# EAGLE design Caff_v3 (EAGLE 9.6.2)
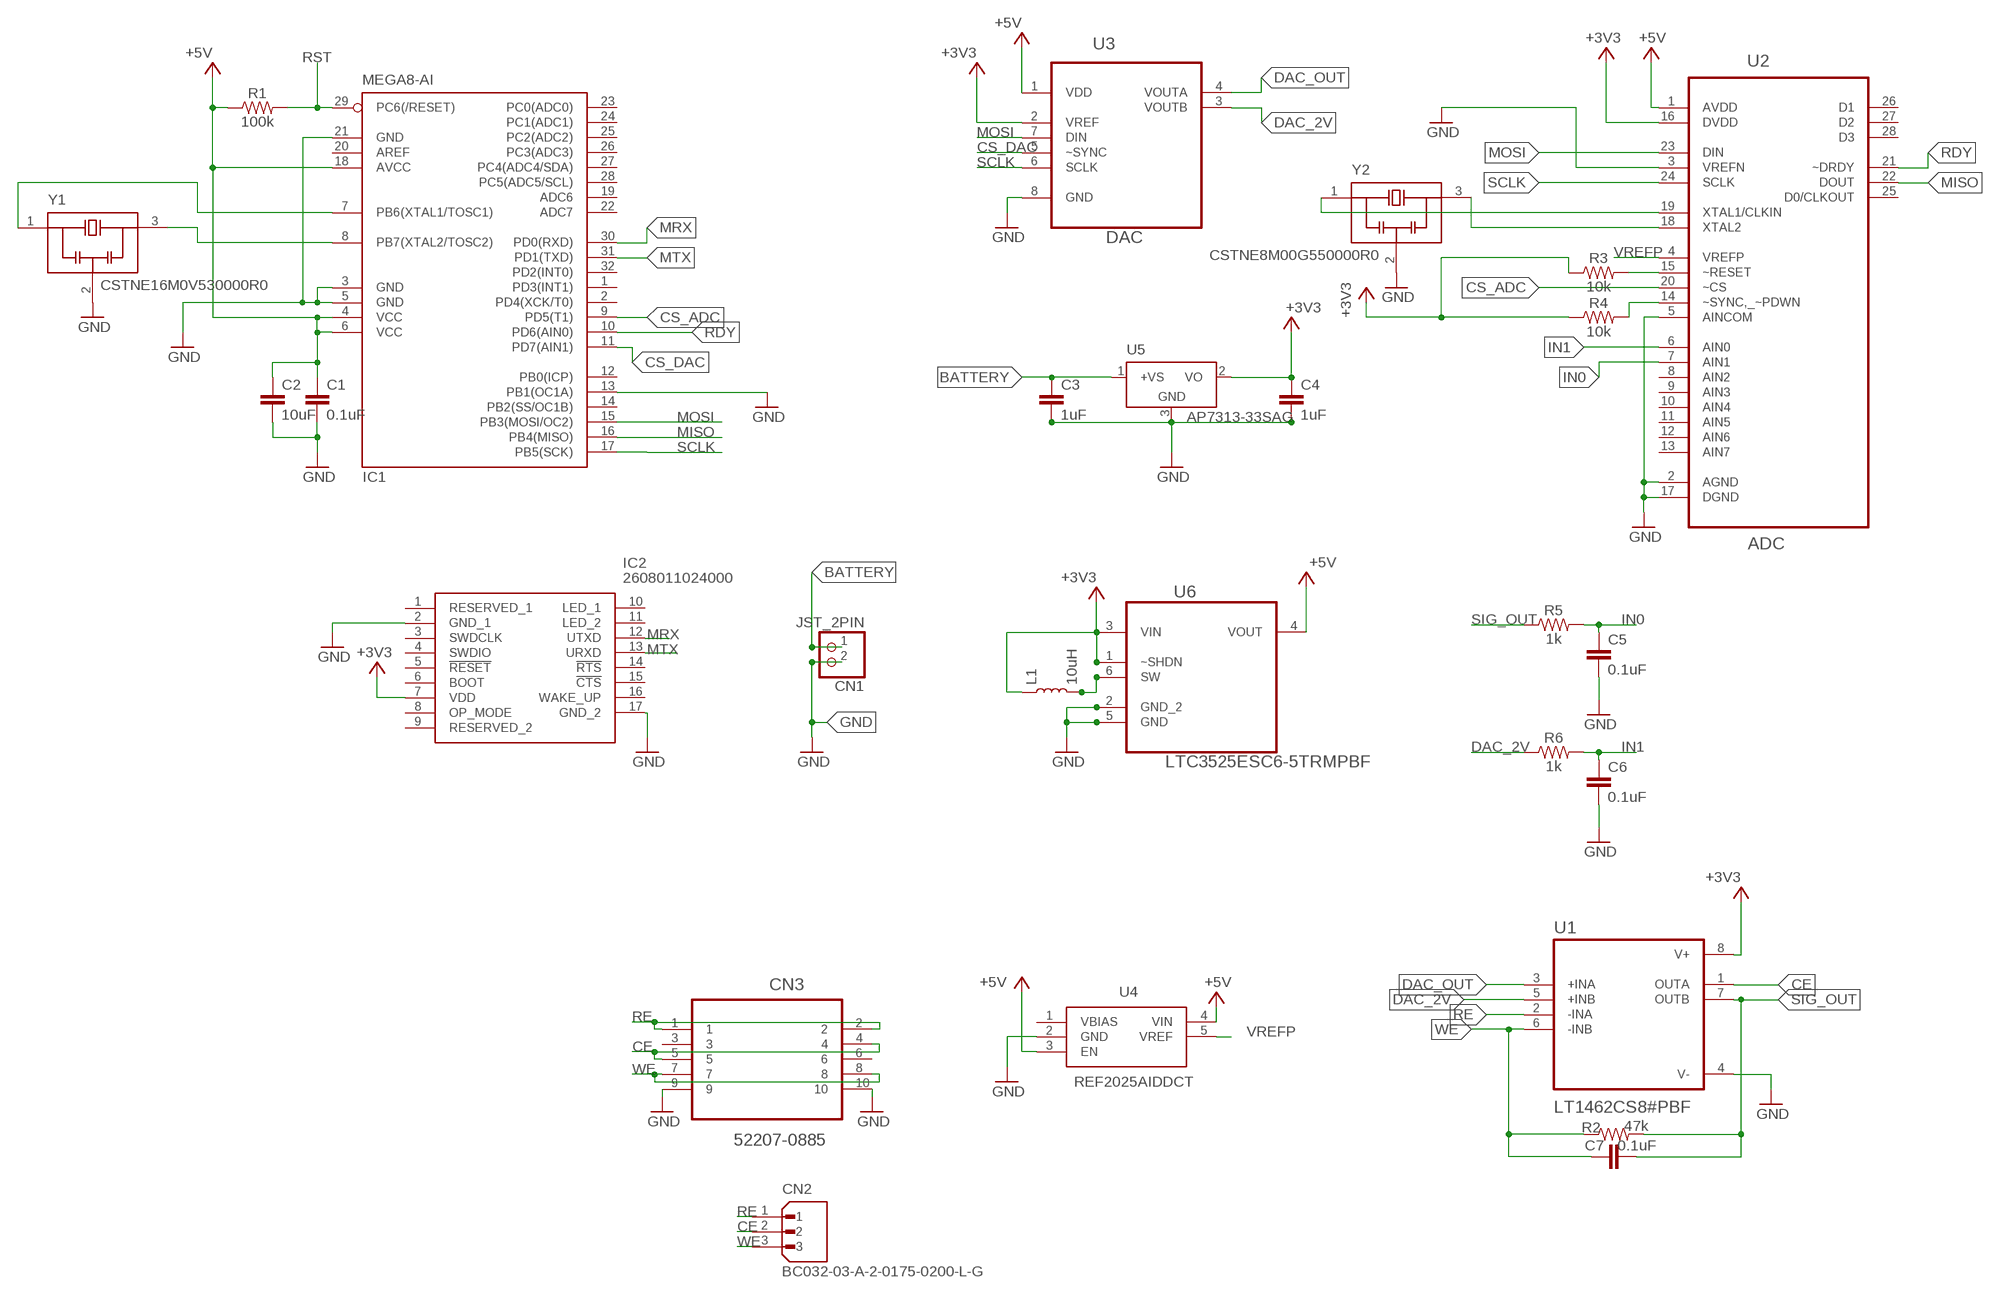
[diagram p0: schematic, sheet 1]

## Parts
C1  0.1uF  0.1UF-0603-25V-5%  [0603]
C2  10uF  10UF-0603-6.3V-20%  [0603]
C3  1uF  0.1UF-0603-25V-(+80/-20%)  [0603]
C4  1uF  0.1UF-0603-25V-(+80/-20%)  [0603]
C5  0.1uF  0.1UF-0603-25V-(+80/-20%)  [0603]
C6  0.1uF  0.1UF-0603-25V-(+80/-20%)  [0603]
C7  0.1uF  0.1UF-0603-25V-5%  [0603]
CN1  JST_2PIN  JST_2PIN-SMT-RA  [JST-PH-2-SMT-RA]
CN2  BC032-03-A-2-0175-0200-L-G  [GCT_BC032-03-A-2-0175-0200-L-G]
CN3  52207-0885  [MOLEX_52207-0885]
IC1  MEGA8-AI  [TQFP32-08]
IC2  2608011024000  [2608011024000]
L1  10uH  INDUCTOR-0603-33NH  [0603]
R1  100k  100KOHM-0603-1/10W-1%  [0603]
R2  47k  47KOHM-0603-1/10W-1%  [0603]
R3  10k  10KOHM-0603-1/10W-1%  [0603]
R4  10k  10KOHM-0603-1/10W-1%  [0603]
R5  1k  10KOHM-0603-1/10W-1%  [0603]
R6  1k  10KOHM-0603-1/10W-1%  [0603]
U1  LT1462CS8#PBF  [SOIC127P600X175-8N]
U2  ADC  ADS1256IDBR  [SOP65P780X200-28N]
U3  DAC  DAC8552IDGKT  [SOP65P490X110-8N]
U4  REF2025AIDDCT  [SOT95P280X110-5N]
U5  AP7313-33SAG  LM50  [SOT23]
U6  LTC3525ESC6-5TRMPBF  [SOT65P210X100-6N]
Y1  CSTNE16M0V530000R0  [OSC_CSTNE16M0V530000R0]
Y2  CSTNE8M00G550000R0  CSTNE16M0V530000R0  [OSC_CSTNE16M0V530000R0]

## Nets
+3V3: C4.1 IC2.7(VDD) L1.1 R3.1 R4.1 U1.8(V+) U2.16(DVDD) U3.2(VREF) U5.2(VO) U6.1(~SHDN) U6.3(VIN)
+5V: C1.1 C2.1 IC1.4(VCC) IC1.6(VCC) IC1.18(AVCC) R1.1 U2.1(AVDD) U3.1(VDD) U4.3(EN) U4.4(VIN) U6.4(VOUT)
BATTERY: C3.1 CN1.1 U5.1(+VS)
CE: CN2.2 CN3.4 CN3.5 U1.1(OUTA)
CS_ADC: IC1.9(PD5(T1)) U2.20(~CS)
CS_DAC: IC1.11(PD7(AIN1)) U3.5(~SYNC)
DAC_2V: R6.1 U1.5(+INB) U3.3(VOUTB)
DAC_OUT: U1.3(+INA) U3.4(VOUTA)
GND: C1.2 C2.2 C3.2 C4.2 C5.2 C6.2 CN1.2 CN3.9 CN3.10 IC1.3(GND) IC1.5(GND) IC1.13(PB1(OC1A)) IC1.21(GND) IC2.2(GND_1) IC2.17(GND_2) U1.4(V-) U2.2(AGND) U2.3(VREFN) U2.5(AINCOM) U2.17(DGND) U3.8(GND) U4.2(GND) U5.3(GND) U6.2(GND_2) U6.5(GND) Y1.2(GND) Y2.2(GND)
IN0: C5.1 R5.2 U2.7(AIN1)
IN1: C6.1 R6.2 U2.6(AIN0)
MISO: IC1.16(PB4(MISO)) U2.22(DOUT)
MOSI: IC1.15(PB3(MOSI/OC2)) U2.23(DIN) U3.7(DIN)
MRX: IC1.30(PD0(RXD)) IC2.12(UTXD)
MTX: IC1.31(PD1(TXD)) IC2.13(URXD)
N$1: IC1.7(PB6(XTAL1/TOSC1)) Y1.1(IN)
N$2: IC1.8(PB7(XTAL2/TOSC2)) Y1.3(OUT)
N$3: U2.19(XTAL1/CLKIN) Y2.1(IN)
N$4: U2.18(XTAL2) Y2.3(OUT)
N$15: R3.2 U2.15(~RESET)
N$17: L1.2 U6.6(SW)
N$18: R4.2 U2.14(~SYNC,_~PDWN)
RDY: IC1.10(PD6(AIN0)) U2.21(~DRDY)
RE: CN2.1 CN3.1 CN3.2 U1.2(-INA)
RST: IC1.29(PC6(/RESET)) R1.2
SCLK: IC1.17(PB5(SCK)) U2.24(SCLK) U3.6(SCLK)
SIG_OUT: C7.2 R2.2 R5.1 U1.7(OUTB)
VREFP: U2.4(VREFP) U4.5(VREF)
WE: C7.1 CN2.3 CN3.7 CN3.8 R2.1 U1.6(-INB)
Unconnected: CN3.3 CN3.6 IC1.1(PD3(INT1)) IC1.2(PD4(XCK/T0)) IC1.12(PB0(ICP)) IC1.14(PB2(SS/OC1B)) IC1.19(ADC6) IC1.20(AREF) IC1.22(ADC7) IC1.23(PC0(ADC0)) IC1.24(PC1(ADC1)) IC1.25(PC2(ADC2)) IC1.26(PC3(ADC3)) IC1.27(PC4(ADC4/SDA)) IC1.28(PC5(ADC5/SCL)) IC1.32(PD2(INT0)) IC2.1(RESERVED_1) IC2.3(SWDCLK) IC2.4(SWDIO) IC2.5(!RESET) IC2.6(BOOT) IC2.8(OP_MODE) IC2.9(RESERVED_2) IC2.10(LED_1) IC2.11(LED_2) IC2.14(!RTS) IC2.15(!CTS) IC2.16(WAKE_UP) U2.8(AIN2) U2.9(AIN3) U2.10(AIN4) U2.11(AIN5) U2.12(AIN6) U2.13(AIN7) U2.25(D0/CLKOUT) U2.26(D1) U2.27(D2) U2.28(D3) U4.1(VBIAS)

## Library data of the parts
C1 C7 = SparkFun-Capacitors:0.1UF: 0.1µF ceramic capacitors A capacitor is a passive two-terminal electrical component used to store electrical energy temporarily in an electric field.; PROD_ID: CAP-08604
C2 = SparkFun-Capacitors:10UF: 10.0µF ceramic capacitors A capacitor is a passive two-terminal electrical component used to store electrical energy temporarily in an electric field.; PROD_ID: CAP-11015
C3 C4 = SparkFun-Capacitors:0.1UF: 0.1µF ceramic capacitors A capacitor is a passive two-terminal electrical component used to store electrical energy temporarily in an electric field.; PROD_ID: CAP-00810; VALUE: 0.1uF
C5 C6 = SparkFun-Capacitors:0.1UF: 0.1µF ceramic capacitors A capacitor is a passive two-terminal electrical component used to store electrical energy temporarily in an electric field.; PROD_ID: CAP-00810
CN1 = adafruit:JST_2PIN: JST 2-Pin Connectors of various flavors SMT-RA (S2B-PH-SM4) 4UConnector #17311 SMT (B2B-PH-SM4) THM-RA (S2B-PH) THM (B2B-PH)
CN2 = BC032-03-A-2-0175-0200-L-G:BC032-03-A-2-0175-0200-L-G: Check availability <https://pricing.snapeda.com/parts/BC032-03-A-2-0175-0200-L-G/Global%20Connector%20Technology/view-part?ref=eda>; AVAILABILITY: Not in stock; DESCRIPTION: 1.00mm pitch Header Board to Board Connector; MF: Global Connector Technology; MP: BC032-03-A-2-0175-0200-L-G; PACKAGE: Package; PRICE: None
CN3 = 52207-0885:52207-0885: SOCKET FPC, SMT, 1MM, 8 WAY; AVAILABILITY: Unavailable; DESCRIPTION: Pin and Socket Header PCB - Right-Angle 8P; MF: Molex; MP: 52207-0885; PACKAGE: None; PRICE: None
IC1 = atmel:MEGA8: MICROCONTROLLER 8 Kbytes FLASH, 1 kbytes SRAM, 512 bytes EEPROM, USART, 6-channel 10 bit ADC, 2-channel 8 bit ADC Pin compatible with Atmega48, ATMega88, ATMega168 Source: avr.lbr; MPN: ATMEGA8-16AU; OC_FARNELL: 9171371; OC_NEWARK: 73M8863
IC2 = SamacSys_Parts:2608011024000: Bluetooth Modules (802.15.1) WIRL-BTLE Proteus-I BLE4.2 Source: Datasheet <https://componentsearchengine.com/Datasheets/1/2608011024000.pdf>; DESCRIPTION: Bluetooth Modules (802.15.1) WIRL-BTLE Proteus-I BLE4.2; HEIGHT: 2.2mm; MANUFACTURER_NAME: Wurth Elektronik; MANUFACTURER_PART_NUMBER: 2608011024000; MOUSER_PART_NUMBER: 710-2608011024000; MOUSER_PRICE-STOCK: https://www.mouser.com/Search/Refine.aspx?Keyword=710-2608011024000
L1 = SparkFun-Coils:INDUCTOR: Inductors Resist changes in electrical current. Basically a coil of wire. SparkFun Products: SparkFun Load Cell Amplifier - HX711 <https://www.sparkfun.com/products/13879> IOIO-OTG - V2.2 <https://www.sparkfun.com/products/13613>; PROD_ID: NDUC-07874; VALUE: 33nH/±5%/500mA
R1 = SparkFun-Resistors:100KOHM: 100kΩ resistor A resistor is a passive two-terminal electrical component that implements electrical resistance as a circuit element. Resistors act to reduce current flow, and, at the same time, act to lower voltage levels within circuits. - Wikipedia; PROD_ID: RES-07828
R2 = SparkFun-Resistors:47KOHM: 47kΩ resistor A resistor is a passive two-terminal electrical component that implements electrical resistance as a circuit element. Resistors act to reduce current flow, and, at the same time, act to lower voltage levels within circuits. - Wikipedia; PROD_ID: RES-07871
R3 R4 = SparkFun-Resistors:10KOHM: 10kΩ resistor A resistor is a passive two-terminal electrical component that implements electrical resistance as a circuit element. Resistors act to reduce current flow, and, at the same time, act to lower voltage levels within circuits. - Wikipedia; PROD_ID: RES-00824
R5 R6 = SparkFun-Resistors:10KOHM: 10kΩ resistor A resistor is a passive two-terminal electrical component that implements electrical resistance as a circuit element. Resistors act to reduce current flow, and, at the same time, act to lower voltage levels within circuits. - Wikipedia; PROD_ID: RES-00824; VALUE: 10k
U1 = LT1462CS8_PBF:LT1462CS8#PBF: None; AVAILABILITY: Unavailable; DESCRIPTION: General Purpose Amplifier 2 Circuit 8-SO; MF: Linear Technology; MP: LT1462CS8#PBF; PACKAGE: SO-8 Linear Technology; PRICE: None
U2 = ADS1256IDBR:ADS1256IDBR: ADC; AVAILABILITY: Unavailable; DESCRIPTION: 24 Bit, 30kSPS Very Low Noise Delta-Sigma ADC with Multiplexer 28-SSOP -40 to 85; MF: Texas Instruments; MP: ADS1256IDBR; PACKAGE: SSOP-28 Texas Instruments; PRICE: None
U3 = DAC8552IDGKT:DAC8552IDGKT: 0.05ìV/°C max, SINGLE-SUPPLY CMOS OPERATIONAL AMPLIFIERS Zer.-Drift Series; AVAILABILITY: Unavailable; DESCRIPTION: 16-Bit, Dual-Channel, Ultralow Glitch, Voltage Output, Digital to Analog Converter 8-VSSOP -40 to 105; MF: Texas Instruments; MP: DAC8552IDGKT; PACKAGE: MSOP-8 Texas Instruments; PRICE: None
U4 = REF2025AIDDCT:REF2025AIDDCT: 8ppm/C Drift, Low-Power, Dual-Output Vref and Vref/2 Voltage Reference Source: Datasheet <http://www.ti.com/lit/gpn/REF2025>; DESCRIPTION: 8ppm/C Drift, Low-Power, Dual-Output Vref and Vref/2 Voltage Reference; HEIGHT: 1.1mm; MANUFACTURER_NAME: Texas Instruments; MANUFACTURER_PART_NUMBER: REF2025AIDDCT; MOUSER_PART_NUMBER: 595-REF2025AIDDCT; MOUSER_PRICE-STOCK: https://www.mouser.co.uk/ProductDetail/Texas-Instruments/REF2025AIDDCT?qs=7z%252BmIopC6%2FK55JDJkOyZiA%3D%3D
U5 = linear:LM50: SOT-23 Single-Supply Centigrade Temperature Sensor Vout = (10mV/°C x Temp °C) +5mmmV Source: http://cache.national.com/ds/LM/LM50.pdf; MF: NATIONAL SEMICONDUCTOR; MPN: LM5008MM/NOPB; OC_NEWARK: 41K6028
U6 = LTC_By_element14_Batch_1:LTC3525ESC6-5TRMPBF: Step-Up DC/DC Converter; OC_FARNELL: 1663905; OC_NEWARK: unknown; PACKAGE: SC70-6; SUPPLIER: LINEAR TECHNOLOGY
Y1 Y2 = CSTNE16M0V530000R0:CSTNE16M0V530000R0: 16MHz Ceramic Resonator Built in Capacitor 15pF ±0.15% 40 Ohms -40°C ~ 125°C Surface Mount; DESCRIPTION: 16 MHz Ceramic Resonator Built in Capacitor 15 pF ±0.3% 40 Ohms -40°C ~ 85°C Surface Mount; DIGI-KEY_PART_NUMBER: 490-17948-2-ND; MF: Murata Electronics; MP: CSTNE16M0V530000R0; PACKAGE: SMD-3 Murata; PURCHASE-URL: https://pricing.snapeda.com/search/part/CSTNE16M0V530000R0/?ref=eda

## Module ADS1255IDBR
Ports: 

### Library data of the parts

## Board
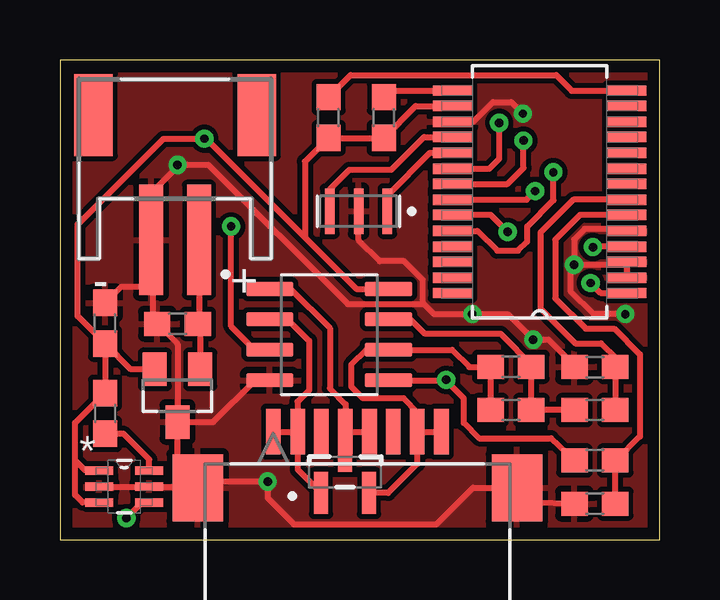
[diagram p1: board, top side]
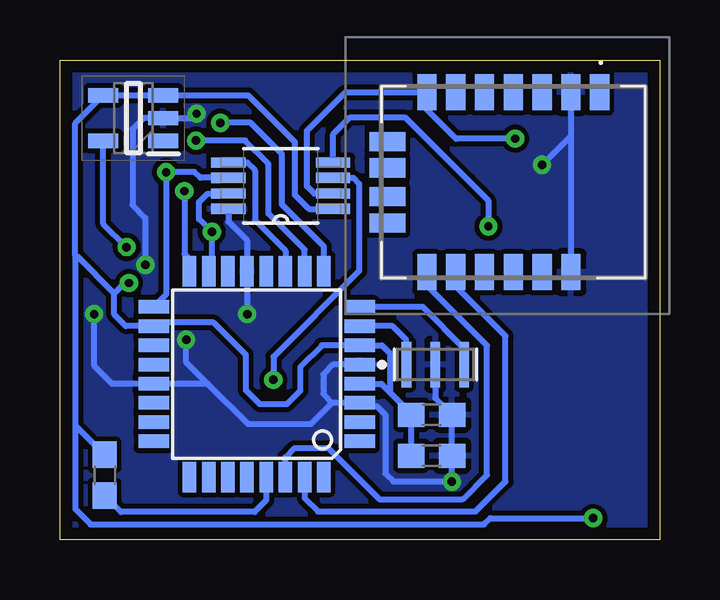
[diagram p2: board, bottom side, seen from below]

Size 25 x 20 mm. Coordinates in mm from the lower left corner, seen from the top.
Outline: 0,0 25,0 25,20 0,20 0,0
Copper layers (1*16): Top 0.07mm / dielectric 1.5mm / Bottom 0.07mm
Design rules "default *": minimum track width 10mil, minimum drill 0.35mm, track to track 8mil, track to pad 8mil, pad to pad 8mil, via to via 8mil, smd to smd 8mil, copper to edge 20mil, drill to drill 8mil, minimum pad ring 10mil, minimum via ring 8mil, stop-mask expansion 4mil, vias tented up to drill 20mil, thermal gap 10mil

### Footprints (pad centres in the part's own frame; a part is rotated, then mirrored left to right if it is on the bottom)
0603 = smd 1.1 x 1: 1 -0.85,0; 2 0.85,0
JST-PH-2-SMT-RA = smd 1 x 4.6: 1 1,-3.7; 2 -1,-3.7 | smd 1.6 x 3.4: NC1 -3.4,1.5; NC2 3.4,1.5
GCT_BC032-03-A-2-0175-0200-L-G = smd 0.6 x 1.75: 1 1,0.875; 2 0,-0.875; 3 -1,0.875
MOLEX_52207-0885 = smd 0.61 x 1.905: 1 3.505,4.801; 2 2.489,4.801; 3 1.499,4.801; 4 0.508,4.801; 5 -0.508,4.801; 6 -1.499,4.801; 7 -2.489,4.801; 8 -3.505,4.801 | smd 2.108 x 2.794: 9 -6.655,7.137; 10 6.655,7.137
TQFP32-08 = smd 1.27 x 0.559: 1 -4.293,2.8; 2 -4.293,2; 3 -4.293,1.2; 4 -4.293,0.4; 5 -4.293,-0.4; 6 -4.293,-1.2; 7 -4.293,-2; 8 -4.293,-2.8; 17 4.293,-2.8; 18 4.293,-2; 19 4.293,-1.2; 20 4.293,-0.4; 21 4.293,0.4; 22 4.293,1.2; 23 4.293,2; 24 4.293,2.8 | smd 0.559 x 1.27: 9 -2.8,-4.293; 10 -2,-4.293; 11 -1.2,-4.293; 12 -0.4,-4.293; 13 0.4,-4.293; 14 1.2,-4.293; 15 2,-4.293; 16 2.8,-4.293; 25 2.8,4.293; 26 2,4.293; 27 1.2,4.293; 28 0.4,4.293; 29 -0.4,4.293; 30 -1.2,4.293; 31 -2,4.293; 32 -2.8,4.293
2608011024000 = smd 0.8 x 1.5: 1 -3.6,-3.75; 2 -2.4,-3.75; 3 -1.2,-3.75; 4 0,-3.75; 5 1.2,-3.75; 6 2.4,-3.75; 7 3.6,-3.75; 12 3.6,3.75; 13 2.4,3.75; 14 1.2,3.75; 15 0,3.75; 16 -1.2,3.75; 17 -2.4,3.75 | smd 1.5 x 0.8: 8 5.25,-1.7; 9 5.25,-0.6; 10 5.25,0.6; 11 5.25,1.7
SOIC127P600X175-8N = smd 1.97 x 0.6: 1 -2.475,1.905; 2 -2.475,0.635; 3 -2.475,-0.635; 4 -2.475,-1.905; 5 2.475,-1.905; 6 2.475,-0.635; 7 2.475,0.635; 8 2.475,1.905
SOP65P780X200-28N = smd 1.651 x 0.432: 1 -3.632,4.216; 2 -3.632,3.581; 3 -3.632,2.921; 4 -3.632,2.286; 5 -3.632,1.626; 6 -3.632,0.965; 7 -3.632,0.33; 8 -3.632,-0.33; 9 -3.632,-0.965; 10 -3.632,-1.626; 11 -3.632,-2.286; 12 -3.632,-2.921; 13 -3.632,-3.581; 14 -3.632,-4.216; 15 3.632,-4.216; 16 3.632,-3.581; 17 3.632,-2.921; 18 3.632,-2.286; 19 3.632,-1.626; 20 3.632,-0.965; 21 3.632,-0.33; 22 3.632,0.33; 23 3.632,0.965; 24 3.632,1.626; 25 3.632,2.286; 26 3.632,2.921; 27 3.632,3.581; 28 3.632,4.216
SOP65P490X110-8N = smd 1.422 x 0.432: 1 -2.184,0.965; 2 -2.184,0.33; 3 -2.184,-0.33; 4 -2.184,-0.965; 5 2.184,-0.965; 6 2.184,-0.33; 7 2.184,0.33; 8 2.184,0.965
SOT95P280X110-5N = smd 1.25 x 0.6: 1 -1.25,0.95; 2 -1.25,0; 3 -1.25,-0.95; 4 1.25,-0.95; 5 1.25,0.95
SOT23 = smd 1 x 1.4: 1 -0.95,-1.1; 2 0.95,-1.1; 3 0,1.1
SOT65P210X100-6N = smd 1.168 x 0.356: 1 -1.041,0.66; 2 -1.041,0; 3 -1.041,-0.66; 4 1.041,-0.66; 5 1.041,0; 6 1.041,0.66
OSC_CSTNE16M0V530000R0 = smd 0.4 x 1.9: 1 -1.2,0; 2 0,0; 3 1.2,0

### Placement (x,y rotation side)
C1  9.5,3.5 0 bottom
C2  9.5,5.2 0 bottom
C3  4.9,9 180 top
C4  1.88,9.02 90 top
C5  22.3,7.2 180 top
C6  22.3,1.5 180 top
C7  18.8,7.2 0 top
CN1  4.8,16.2 0 top
CN2  11.89,2.82 180 top
CN3  12.4,9.3 180 top
IC1  16.8,6.9 180 bottom
IC2  6.1,14.9 180 bottom
L1  1.88,5.26 270 top
R1  23.14,2.68 270 bottom
R2  18.8,5.4 0 top
R3  13.5,17.6 90 top
R4  11.2,17.6 90 top
R5  22.3,5.4 0 top
R6  22.3,3.3 0 top
U1  11.22,8.55 0 top
U2  20,14.5 180 top
U3  15.79,14.76 180 bottom
U4  21.94,17.57 180 bottom
U5  4.9,6 180 top
U6  2.68,2.21 0 top
Y1  9.35,7.3 0 bottom
Y2  12.45,13.69 180 top

### Tracks (layer width: path | path; a pad name or v marks a point on that pad's centre or on a via)
+3V3  (via drill 0.35)
  Top 0.254: C4.1 L1.1 0.64,4.87 0.64,3.31 | U6.3 0.95,1.55 0.64,1.86 0.64,3.31 | U6.1 1.07,2.87 0.64,3.31 | U2.16 14.83,18.08 R3.1 R4.1 10.21,15.76 10.21,12.6 | C4.1 0.74,9.31 0.74,13.14 4.32,16.72 v6.02,16.72 6.1,16.72 10.21,12.6 | U1.8 12.36,10.45 10.21,12.6 | U5.2 2.95,7.1 C4.1
  Bottom 0.254: U3.2 14.4,14.43 14.71,14.74 14.71,17.05 13.1,18.65 IC2.7 9.7,17.94 8.48,16.72 v6.02,16.72
+5V  (via drill 0.35)
  Top 0.254: v22.12,10.7 22.54,10.28 U2.1 | v2.77,0.89 3.42,1.55 U6.4
  Bottom 0.254: C1.1 C2.1 10.35,5.25 11.24,6.14 | IC1.4 11.6,6.5 11.24,6.14 | 11.24,6.14 11.24,7.76 11.58,8.1 IC1.6 14.08,8.1 14.99,7.19 14.99,6.2 15.54,5.64 16.66,5.64 17.25,6.23 17.25,7.7 18.59,9.05 20.95,9.05 IC1.18 22.26,8.9 22.73,9.38 22.73,10.27 | R1.1 24.36,4.75 | U3.1 14.62,13.79 15.21,14.38 15.21,16.59 17.15,18.52 U4.3 U4.4 24.36,17.36 24.36,11.81 | 24.36,11.81 24.36,4.75 | 22.73,10.27 22.3,10.7 v22.12,10.7 | 22.73,10.27 24.28,11.81 24.36,11.81 | 24.36,4.75 24.36,1.27 23.72,0.64 7.32,0.64 7.06,0.89 v2.77,0.89
BATTERY
  Top 0.254: C3.1 5.85,8.9 U5.1 | CN1.1 5.8,9.05
  Top 0.381: 5.8,9.05 C3.1
CE
  Top 0.254: U1.1 9.62,10.45 11.25,8.82 11.25,6.3 11.91,5.64 11.91,4.52 CN3.4 | CN3.4 CN3.5 | CN3.4 CN2.2
CS_ADC  (via drill 0.35)
  Top 0.254: U2.20 17.9,15.46 18.31,15.88 v18.31,17.38
  Bottom 0.254: IC1.9 14,12.23 15.75,13.97 15.75,16.08 17.04,17.38 v18.31,17.38
CS_DAC
  Bottom 0.254: U3.5 17.19,15.72 16.87,15.4 16.87,13.31 15.6,12.05 IC1.11
DAC_2V  (via drill 0.35)
  Top 0.254: R6.1 20.48,4.22 17.48,4.22 16.84,4.86 16.84,5.89 16.09,6.64 | 16.09,6.64 v16.1,6.66 | U1.5 16.09,6.64
  Bottom 0.254: U3.3 12.77,15.09 12.52,14.84 12.52,11.21 16.1,7.62 v16.1,6.66
DAC_OUT  (via drill 0.35)
  Top 0.254: U1.3 8.12,7.91 7.14,8.89 v7.14,13.06
  Bottom 0.254: U3.4 13.61,16.9 12.9,17.61 10.62,17.61 7.14,14.13 v7.14,13.06
GND  (via drill 0.35)
  Top 0.254: 3.87,9.18 3.87,12.43 CN1.2 3.8,14.45 4.9,15.55 v4.9,15.62 6.2,15.62 12.01,9.81 15.18,9.81 | C4.2 2.55,10.54 3.8,10.54 | CN3.10 4.9,3.01 U5.3 | C3.2 4.9,8.15 U5.3 | Y2.2 12.45,12.5 13.34,11.61 14.35,11.61 15.13,10.83 15.13,9.87 15.18,9.81 | U5.3 6.39,4.9 8.14,6.64 U1.4 | U2.17 17.24,17.42 18.06,18.24 18.82,18.24 v19.3,17.76 | 23.63,11.48 U2.3 | C6.2 19.69,1.53 CN3.9 17.23,2.16 15.7,0.64 9.76,0.64 8.66,1.73 v8.66,2.42 v8.66,2.41 6,2.41 CN3.10 | U2.5 23.55,12.96 21.88,12.96 21.44,12.51 v21.44,11.46 | 23.63,11.48 U2.2 | v23.57,9.4 22.25,9.4 21.29,10.36 21.29,11.31 v21.44,11.46 | v21.44,11.46 23.61,11.46 23.63,11.48 | 15.18,9.81 15.59,9.4 v17.2,9.4 18.67,9.4 v19.74,8.34 20.38,8.34 21.49,7.22 C5.2 | U6.2 U6.5 5.7,2.21 CN3.10
  Top 0.381: 3.8,10.54 CN1.2 | 3.87,9.18 C3.2
  Bottom 0.254: Y1.2 9.35,5.9 C2.2 C1.2 v8.65,2.43 v8.66,2.42 11.1,2.42 11.43,2.75 11.43,5.2 11.79,5.57 12.37,5.57 IC1.3 13.65,5.7 | IC1.5 13.61,7.3 14.02,6.89 14.02,6.07 13.65,5.7 | 18.84,6.5 IC1.21 22.83,6.5 23.57,7.24 v23.57,9.4 | U3.8 17.98,13.26 17.2,12.48 IC1.13 v17.2,9.41 v17.2,9.4 | IC2.2 3.7,16.83 | 3.7,16.83 IC2.17 | v19.3,17.76 19.49,17.57 U4.2 21.52,17.57 21.97,17.12 21.97,13.95 21.44,13.41 v21.44,11.46 | 13.65,5.7 14.54,4.8 17.14,4.8 18.84,6.5 | 18.84,6.5 19.74,7.39 v19.74,8.34 | v4.9,15.62 3.7,16.83
  pour Top: 0,0 25,0 25,20 0,20
  pour Bottom: 0,0 25,0 25,20 0,20
IN0
  Top 0.254: U2.7 21.41,14.17 20.04,12.8 20.04,9.63 21.49,8.18 22.55,8.18 23.19,7.54 C5.1 R5.2
IN1
  Top 0.254: U2.6 21.68,13.54 20.65,12.5 20.65,10.06 21.92,8.79 23.11,8.79 24.19,7.72 24.19,4.3 23.19,3.3 R6.2 C6.1
MISO  (via drill 0.35)
  Top 0.254: v19.81,14.53 19.45,14.17 U2.22
  Bottom 0.254: v19.81,14.53 19.81,11.92 19.6,11.7 IC1.16
MOSI  (via drill 0.35)
  Top 0.254: v18.67,12.83 17.96,13.54 U2.23
  Bottom 0.254: IC1.15 18.67,11.32 v18.67,12.83 19.2,13.36 19.2,14.07 18.85,14.43 U3.7
MRX
  Bottom 0.254: IC1.30 15.6,3.43 15.21,3.81 13.82,3.81 11.68,1.68 8.2,1.68 7.19,2.7 7.19,8.09 9.7,10.6 IC2.12
MTX
  Bottom 0.254: IC1.31 14.8,1.72 14.25,1.17 7.67,1.17 6.43,2.42 6.43,8.49 8.5,10.56 IC2.13
N$1
  Bottom 0.254: Y1.1 10.55,8.32 11.13,8.9 IC1.7
N$2
  Bottom 0.254: Y1.3 8.15,7.98 9.87,9.7 IC1.8
N$3
  Top 0.254: Y2.1 13.65,14.34 15.44,16.13 U2.19
N$4
  Top 0.254: Y2.3 11.25,14.61 12.06,15.42 13.82,15.42 15.18,16.79 U2.18
N$15
  Top 0.254: R3.2 13.77,18.72 U2.15
N$17
  Top 0.254: U6.6 3.72,3.34 2.65,4.41 L1.2
N$18
  Top 0.254: R4.2 12.12,19.36 20.7,19.36 21.34,18.72 U2.14
RDY  (via drill 0.35)
  Top 0.254: U2.21 18.66,14.83 19.33,15.5 v19.33,16.64
  Bottom 0.254: IC1.10 14.8,12.09 16.31,13.59 16.31,15.68 17.27,16.64 v19.33,16.64
RE
  Top 0.254: U1.2 9.49,9.18 10.39,8.28 10.39,6.23 9.91,5.74 CN3.2 | CN3.1 CN3.2 | CN3.2 9.91,2.92 CN2.1
RST
  Bottom 0.254: IC1.29 16.4,1.64 16.88,1.16 22.46,1.16 R1.2
SCLK  (via drill 0.35)
  Top 0.254: U2.24 17.41,12.87 18.24,12.04 19.1,12.04 19.48,12.42 19.48,13.06 20.57,14.15 v20.57,15.32
  Bottom 0.254: U3.6 19.15,15.09 19.39,15.33 20.56,15.33 v20.57,15.32 20.57,10.22 IC1.17
SIG_OUT
  Top 0.254: U1.7 14.61,9.18 15.22,8.57 18.38,8.57 19.73,7.23 C7.2 R2.2 R5.1
VREFP  (via drill 0.35)
  Top 0.254: U2.4 22.24,12.21 v22.23,12.2
  Bottom 0.254: v22.23,12.2 23.19,13.16 U4.5
WE
  Top 0.254: R2.1 C7.1 17.07,7.2 16.35,7.91 U1.6 12.76,7.91 12.14,7.29 12.14,6.38 12.62,5.9 14.33,5.9 14.91,5.31 14.91,4.5 CN3.7 | CN3.7 CN3.8 | CN3.7 14.89,3.15 13.68,1.94 CN2.3

### Text on the board
tValues: 8 MHz
bValues: 16 MHz | Potentiostat Board | Ver: 3.0 | Oct 28, 2022 | kiarashsabet@ucla.edu